# EAGLE design Output_v2_0 (EAGLE 9.6.2)
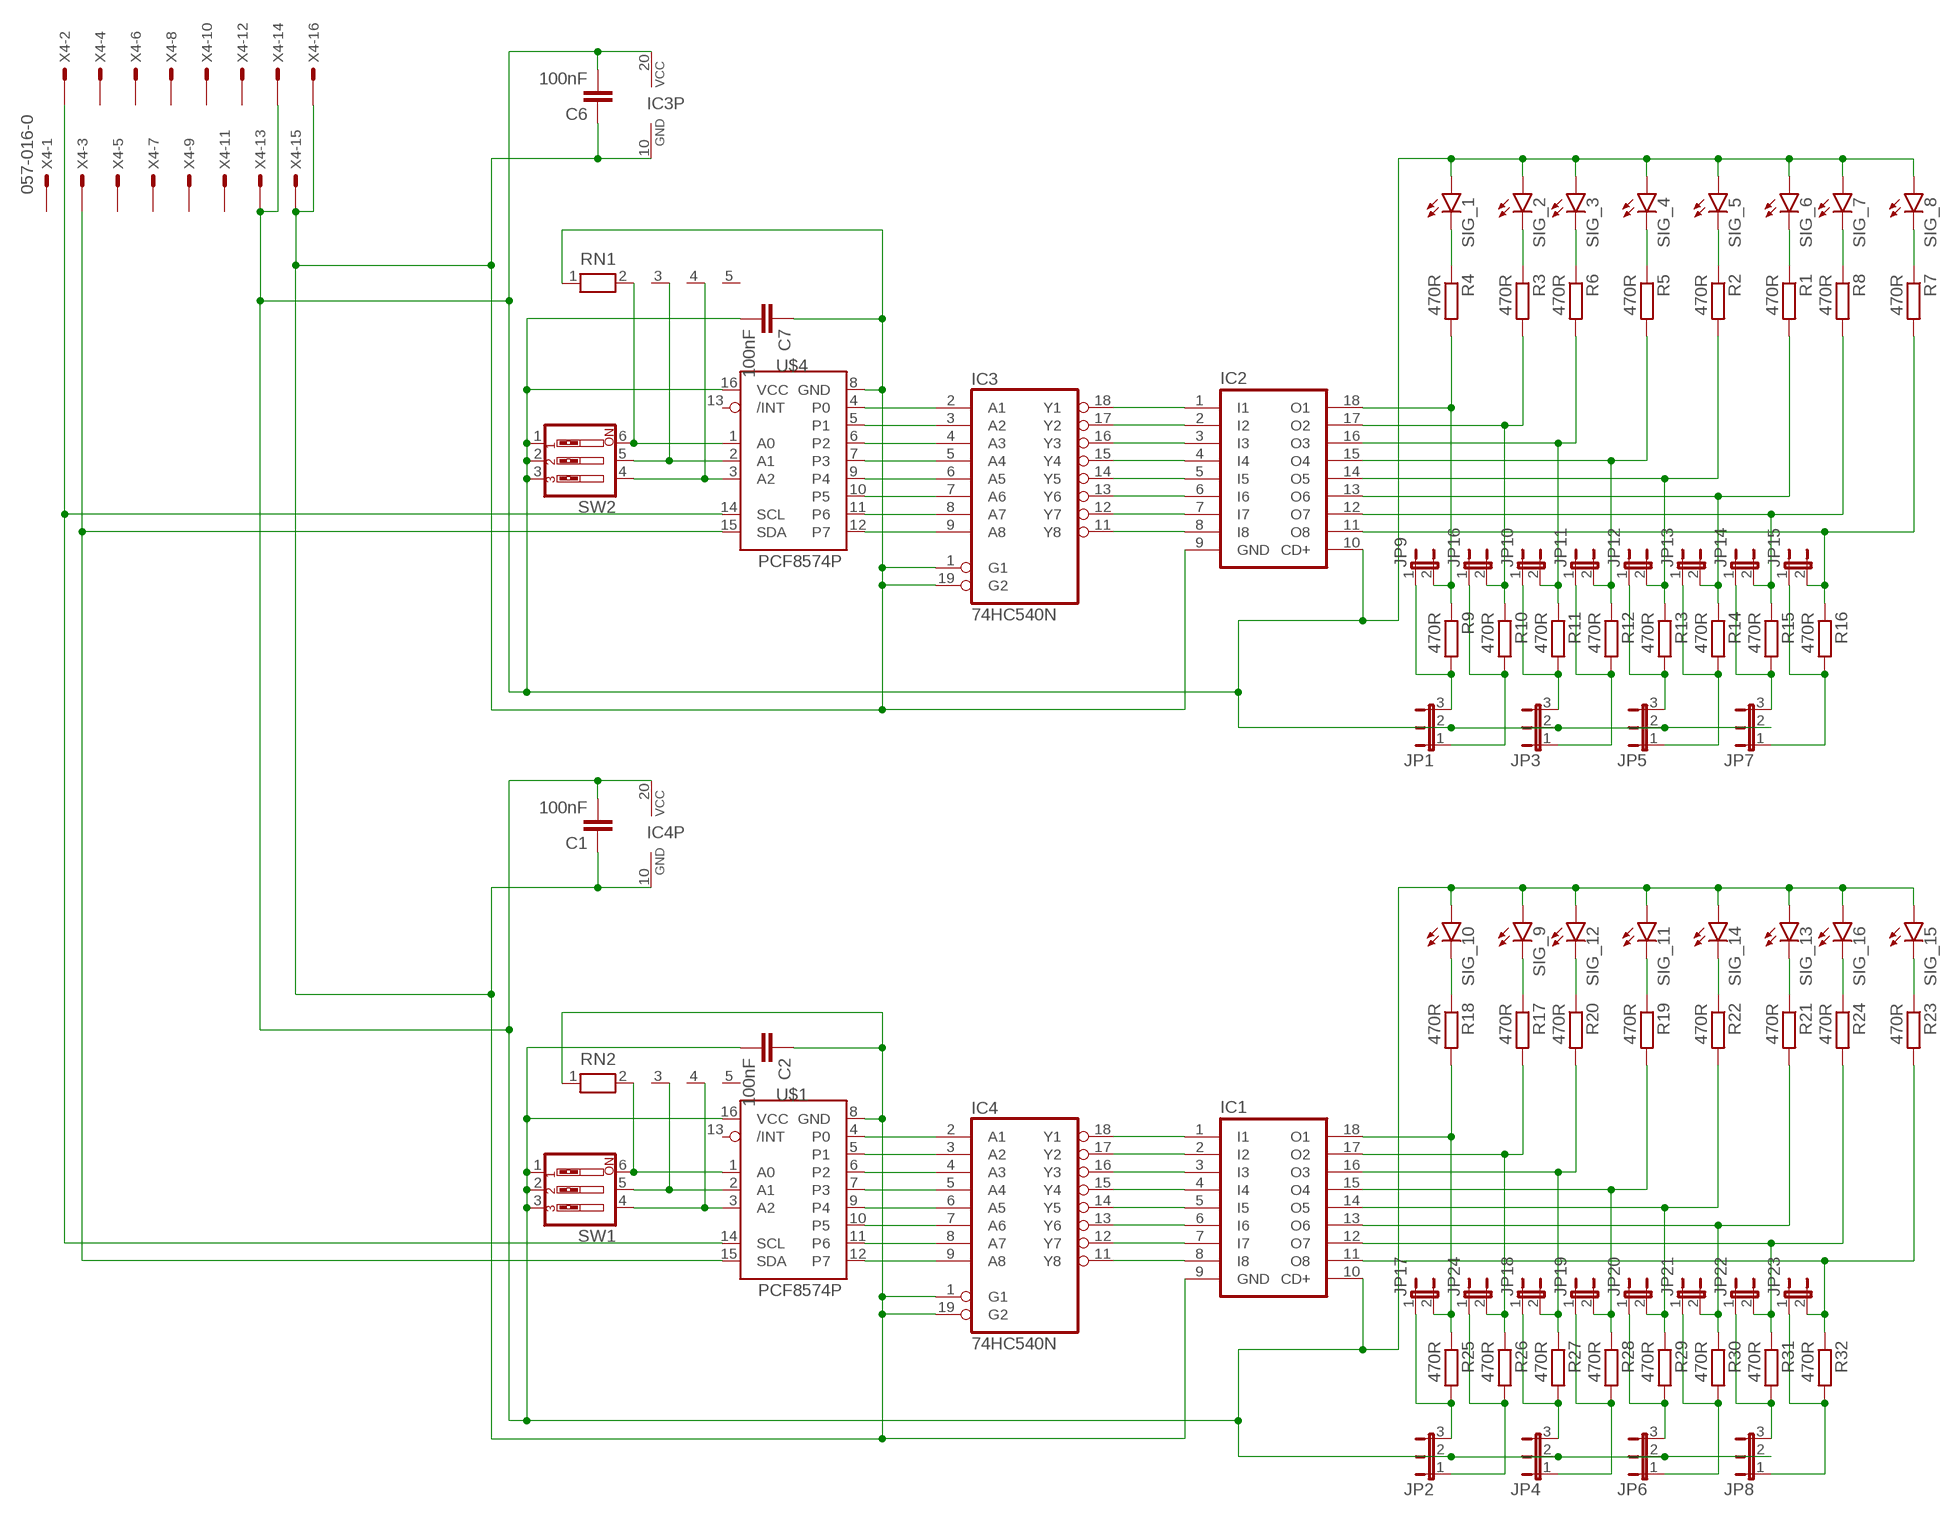
[diagram p0: schematic, sheet 1]

## Parts
C1  100nF  C-EU025-024X044  [C025-024X044]
C2  100nF  C-EU025-024X044  [C025-024X044]
C6  100nF  C-EU025-024X044  [C025-024X044]
C7  100nF  C-EU025-024X044  [C025-024X044]
IC1  ULN2803A  [DIL18]
IC2  ULN2803A  [DIL18]
IC3  74HC540N  [DIL20]
IC4  74HC540N  [DIL20]
JP1  JP2E  [JP2]
JP2  JP2E  [JP2]
JP3  JP2E  [JP2]
JP4  JP2E  [JP2]
JP5  JP2E  [JP2]
JP6  JP2E  [JP2]
JP7  JP2E  [JP2]
JP8  JP2E  [JP2]
JP9  JP1E  [JP1]
JP10  JP1E  [JP1]
JP11  JP1E  [JP1]
JP12  JP1E  [JP1]
JP13  JP1E  [JP1]
JP14  JP1E  [JP1]
JP15  JP1E  [JP1]
JP16  JP1E  [JP1]
JP17  JP1E  [JP1]
JP18  JP1E  [JP1]
JP19  JP1E  [JP1]
JP20  JP1E  [JP1]
JP21  JP1E  [JP1]
JP22  JP1E  [JP1]
JP23  JP1E  [JP1]
JP24  JP1E  [JP1]
R1  470R  R-EU_0309/10  [0309/10]
R2  470R  R-EU_0309/10  [0309/10]
R3  470R  R-EU_0309/10  [0309/10]
R4  470R  R-EU_0309/10  [0309/10]
R5  470R  R-EU_0309/10  [0309/10]
R6  470R  R-EU_0309/10  [0309/10]
R7  470R  R-EU_0309/10  [0309/10]
R8  470R  R-EU_0309/10  [0309/10]
R9  470R  R-EU_0309/10  [0309/10]
R10  470R  R-EU_0309/10  [0309/10]
R11  470R  R-EU_0309/10  [0309/10]
R12  470R  R-EU_0309/10  [0309/10]
R13  470R  R-EU_0309/10  [0309/10]
R14  470R  R-EU_0309/10  [0309/10]
R15  470R  R-EU_0309/10  [0309/10]
R16  470R  R-EU_0309/10  [0309/10]
R17  470R  R-EU_0309/10  [0309/10]
R18  470R  R-EU_0309/10  [0309/10]
R19  470R  R-EU_0309/10  [0309/10]
R20  470R  R-EU_0309/10  [0309/10]
R21  470R  R-EU_0309/10  [0309/10]
R22  470R  R-EU_0309/10  [0309/10]
R23  470R  R-EU_0309/10  [0309/10]
R24  470R  R-EU_0309/10  [0309/10]
R25  470R  R-EU_0309/10  [0309/10]
R26  470R  R-EU_0309/10  [0309/10]
R27  470R  R-EU_0309/10  [0309/10]
R28  470R  R-EU_0309/10  [0309/10]
R29  470R  R-EU_0309/10  [0309/10]
R30  470R  R-EU_0309/10  [0309/10]
R31  470R  R-EU_0309/10  [0309/10]
R32  470R  R-EU_0309/10  [0309/10]
RN1  RN04  [RN-5]
RN2  RN04  [RN-5]
SIG_1  LED3MM  [LED3MM]
SIG_2  LED3MM  [LED3MM]
SIG_3  LED3MM  [LED3MM]
SIG_4  LED3MM  [LED3MM]
SIG_5  LED3MM  [LED3MM]
SIG_6  LED3MM  [LED3MM]
SIG_7  LED3MM  [LED3MM]
SIG_8  LED3MM  [LED3MM]
SIG_9  LED3MM  [LED3MM]
SIG_10  LED3MM  [LED3MM]
SIG_11  LED3MM  [LED3MM]
SIG_12  LED3MM  [LED3MM]
SIG_13  LED3MM  [LED3MM]
SIG_14  LED3MM  [LED3MM]
SIG_15  LED3MM  [LED3MM]
SIG_16  LED3MM  [LED3MM]
SW1  SW_DIP-3  [EDG-03]
SW2  SW_DIP-3  [EDG-03]
U$1  PCF8574P  [DIL16]
U$4  PCF8574P  [DIL16]
X4  057-016-0  [057-016-0]

## Nets
GND2: C1.1 C2.1 C6.1 C7.1 IC1.9(GND) IC2.9(GND) IC3.1(G1) IC3.10(GND) IC3.19(G2) IC4.1(G1) IC4.10(GND) IC4.19(G2) RN1.1 RN2.1 U$1.8(GND) U$4.8(GND) X4.15 X4.16
N$1: JP1.3 JP9.1 R9.2
N$2: IC2.13(O6) JP13.2 R1.2 R14.1
N$3: R2.1 SIG_5.K(C)
N$4: R1.1 SIG_6.K(C)
N$5: IC2.12(O7) JP14.2 R8.2 R15.1
N$6: RN2.4 SW1.4 U$1.3(A2)
N$7: R8.1 SIG_7.K(C)
N$8: R7.1 SIG_8.K(C)
N$9: JP1.1 JP16.1 R10.2
N$10: JP3.3 JP10.1 R11.2
N$11: JP3.1 JP11.1 R12.2
N$12: IC2.8(I8) IC3.11(Y8)
N$13: JP5.3 JP12.1 R13.2
N$14: IC2.7(I7) IC3.12(Y7)
N$15: IC2.6(I6) IC3.13(Y6)
N$16: IC2.5(I5) IC3.14(Y5)
N$17: IC2.4(I4) IC3.15(Y4)
N$18: IC2.3(I3) IC3.16(Y3)
N$19: IC2.2(I2) IC3.17(Y2)
N$20: IC2.1(I1) IC3.18(Y1)
N$21: IC3.2(A1) U$4.4(P0)
N$22: IC3.3(A2) U$4.5(P1)
N$23: IC3.4(A3) U$4.6(P2)
N$24: IC3.5(A4) U$4.7(P3)
N$25: IC3.6(A5) U$4.9(P4)
N$26: IC3.7(A6) U$4.10(P5)
N$27: IC3.8(A7) U$4.11(P6)
N$28: IC3.9(A8) U$4.12(P7)
N$29: IC2.18(O1) JP9.2 R4.2 R9.1
N$30: JP5.1 JP13.1 R14.2
N$31: IC2.17(O2) JP16.2 R3.2 R10.1
N$32: JP7.3 JP14.1 R15.2
N$33: JP7.1 JP15.1 R16.2
N$34: IC1.8(I8) IC4.11(Y8)
N$35: RN2.3 SW1.5 U$1.2(A1)
N$36: R4.1 SIG_1.K(C)
N$37: R3.1 SIG_2.K(C)
N$38: IC2.11(O8) JP15.2 R7.2 R16.1
N$39: IC1.7(I7) IC4.12(Y7)
N$40: IC1.6(I6) IC4.13(Y6)
N$41: IC2.16(O3) JP10.2 R6.2 R11.1
N$42: IC2.15(O4) JP11.2 R5.2 R12.1
N$43: IC2.14(O5) JP12.2 R2.2 R13.1
N$44: IC1.5(I5) IC4.14(Y5)
N$45: IC1.4(I4) IC4.15(Y4)
N$46: IC1.3(I3) IC4.16(Y3)
N$47: IC1.2(I2) IC4.17(Y2)
N$48: IC1.1(I1) IC4.18(Y1)
N$49: IC4.2(A1) U$1.4(P0)
N$50: IC4.3(A2) U$1.5(P1)
N$51: IC4.4(A3) U$1.6(P2)
N$52: IC4.5(A4) U$1.7(P3)
N$53: R6.1 SIG_3.K(C)
N$54: R5.1 SIG_4.K(C)
N$55: IC4.6(A5) U$1.9(P4)
N$56: IC4.7(A6) U$1.10(P5)
N$57: IC4.8(A7) U$1.11(P6)
N$58: IC4.9(A8) U$1.12(P7)
N$59: IC1.18(O1) JP17.2 R18.2 R25.1
N$60: IC1.17(O2) JP24.2 R17.2 R26.1
N$61: R18.1 SIG_10.K(C)
N$62: R17.1 SIG_9.K(C)
N$63: IC1.16(O3) JP18.2 R20.2 R27.1
N$64: IC1.15(O4) JP19.2 R19.2 R28.1
N$65: IC1.14(O5) JP20.2 R22.2 R29.1
N$66: R20.1 SIG_12.K(C)
N$67: R19.1 SIG_11.K(C)
N$68: IC1.13(O6) JP21.2 R21.2 R30.1
N$69: R22.1 SIG_14.K(C)
N$70: R21.1 SIG_13.K(C)
N$71: IC1.12(O7) JP22.2 R24.2 R31.1
N$72: R24.1 SIG_16.K(C)
N$73: R23.1 SIG_15.K(C)
N$74: JP2.3 JP17.1 R25.2
N$75: JP2.1 JP24.1 R26.2
N$76: JP4.3 JP18.1 R27.2
N$77: JP4.1 JP19.1 R28.2
N$78: JP6.3 JP20.1 R29.2
N$79: JP6.1 JP21.1 R30.2
N$80: JP8.3 JP22.1 R31.2
N$81: JP8.1 JP23.1 R32.2
N$82: U$1.14(SCL) U$4.14(SCL) X4.2
N$83: IC1.11(O8) JP23.2 R23.2 R32.1
N$84: U$1.15(SDA) U$4.15(SDA) X4.3
N$85: RN2.2 SW1.6 U$1.1(A0)
N$86: RN1.2 SW2.6 U$4.1(A0)
N$87: RN1.3 SW2.5 U$4.2(A1)
N$88: RN1.4 SW2.4 U$4.3(A2)
VCC5.1: C1.2 C2.2 C6.2 C7.2 IC1.10(CD+) IC2.10(CD+) IC3.20(VCC) IC4.20(VCC) JP1.2 JP2.2 JP3.2 JP4.2 JP5.2 JP6.2 JP7.2 JP8.2 SIG_1.A SIG_2.A SIG_3.A SIG_4.A SIG_5.A SIG_6.A SIG_7.A SIG_8.A SIG_9.A SIG_10.A SIG_11.A SIG_12.A SIG_13.A SIG_14.A SIG_15.A SIG_16.A SW1.1 SW1.2 SW1.3 SW2.1 SW2.2 SW2.3 U$1.16(VCC) U$4.16(VCC) X4.13 X4.14
Unconnected: RN1.5 RN2.5 U$1.13(/INT) U$4.13(/INT) X4.1 X4.4 X4.5 X4.6 X4.7 X4.8 X4.9 X4.10 X4.11 X4.12

## Library data of the parts
C1 C2 C6 C7 = resistor:C-EU: CAPACITOR, European symbol
IC1 IC2 = uln-udn:ULN2803A: DRIVER ARRAY
IC3 IC4 = 74xx-eu:74*540: Inverting Octal BUFFER and LINE DRIVER, 3-state
JP1-JP8 = jumper:JP2E: JUMPER
JP9-JP24 = jumper:JP1E: JUMPER
R1-R32 = resistor:R-EU_: RESISTOR, European symbol
RN1 RN2 = resistor-net:RN04: RESISTOR NETWORK; OC_FARNELL: unknown; OC_NEWARK: unknown
SIG_1-SIG_16 = led:LED: LED OSRAM: - CHIPLED LG R971, LG N971, LY N971, LG Q971, LY Q971, LO R971, LY R971 LH N974, LH R974 LS Q976, LO Q976, LY Q976 LO Q996 - Hyper CHIPLED LW Q18S LB Q993, LB Q99A, LB R99A - SideLED LS A670, LO A670, LY A670, LG A670, LP A670 LB A673, LV A673, LT A673, LW A673 LH A674 LY A675 LS A676, LA A676, LO A676, LY A676, LW A676 LS A679, LY A679, LG A679 - Hyper Micro SIDELED® LS Y876, LA Y876, LO Y876, LY Y876 LT Y87S - SmartLED LW L88C, LW L88S LB L89C, LB L89S, LG L890 LS L89K, LO L89K, LY L89K LS L896, LA L896, LO L896, LY L896 - TOPLED LS T670, LO T670, LY T670, LG T670, LP T670 LSG T670, LSP T670, LSY T670, LOP T670, LYG T670 LG T671, LOG T671, LSG T671 LB T673, LV T673, LT T673, LW T673 LH T674 LS T676, LA T676, LO T676, LY T676, LB T676, LH T676, LSB T676, LW T676 LB T67C, LV T67C, LT T67C, LS T67K, LO T67K, LY T67K, LW E67C LS E67B, LA E67B, LO E67B, LY E67B, LB E67C, LV E67C, LT E67C LW T67C LS T679, LY T679, LG T679 LS T770, LO T770, LY T770, LG T770, LP T770 LB T773, LV T773, LT T773, LW T773 LH T774 LS E675, LA E675, LY E675, LS T675 LS T776, LA T776, LO T776, LY T776, LB T776 LHGB T686 LT T68C, LB T68C - Hyper Mini TOPLED® LB M676 - Mini TOPLED Santana® LG M470 LS M47K, LO M47K, LY M47K Source: http://www.osram.convergy.de LUXEON: - LUMILED® LXK2-PW12-R00, LXK2-PW12-S00, LXK2-PW14-U00, LXK2-PW14-V00 LXK2-PM12-R00, LXK2-PM12-S00, LXK2-PM14-U00 LXK2-PE12-Q00, LXK2-PE12-R00, LXK2-PE12-S00, LXK2-PE14-T00, LXK2-PE14-U00 LXK2-PB12-K00, LXK2-PB12-L00, LXK2-PB12-M00, LXK2-PB14-N00, LXK2-PB14-P00, LXK2-PB14-Q00 LXK2-PR12-L00, LXK2-PR12-M00, LXK2-PR14-Q00, LXK2-PR14-R00 LXK2-PD12-Q00, LXK2-PD12-R00, LXK2-PD12-S00 LXK2-PH12-R00, LXK2-PH12-S00 LXK2-PL12-P00, LXK2-PL12-Q00, LXK2-PL12-R00 Source: www.luxeon.com KINGBRIGHT: KA-3528ASYC Source: www.kingbright.com
SW1 SW2 = special:SW_DIP-3: DIP SWITCH
U$1 U$4 = i2c:PCF8574: Remote 8-Bit I/O Expander for I²C Bus
X4 = con-panduit:057-016-: CONNECTOR 10-pin series 057 contact pc board low profile headers; OC_FARNELL: unknown; OC_NEWARK: unknown

## Board
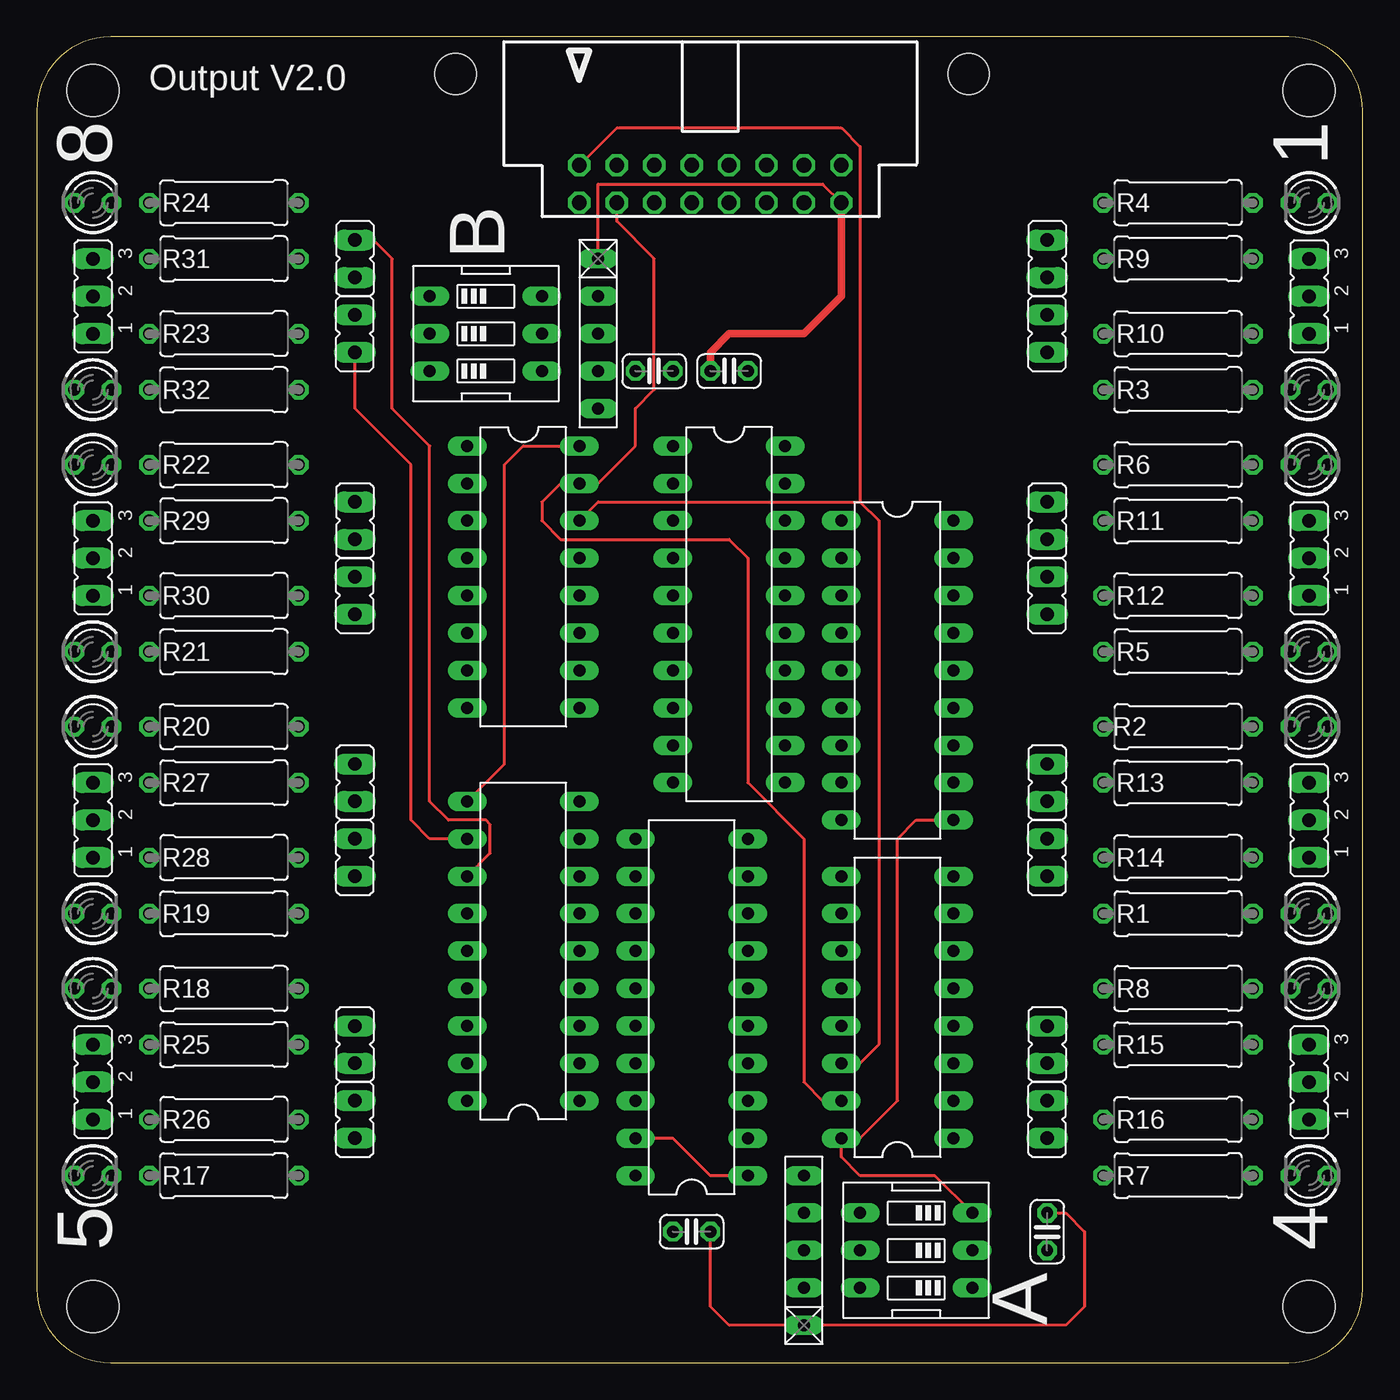
[diagram p1: board, top side]
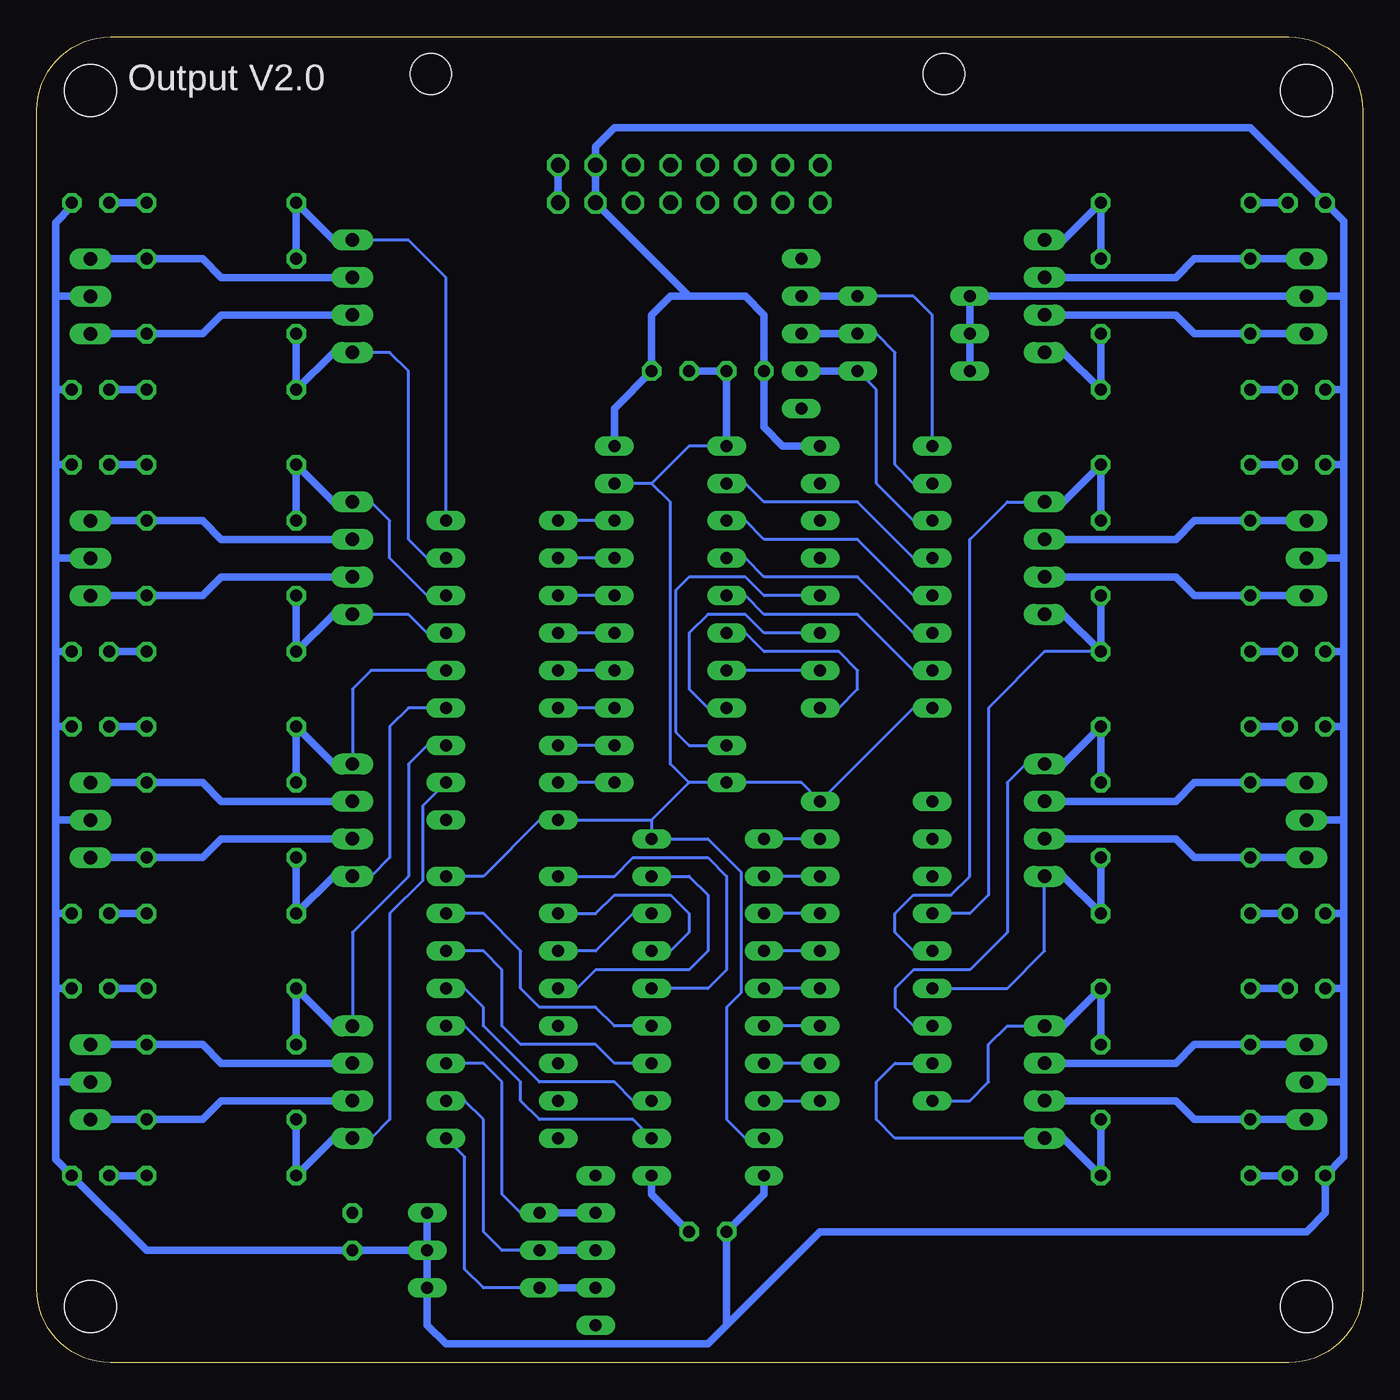
[diagram p2: board, bottom side, seen from below]

Size 90 x 90 mm. Coordinates in mm from the lower left corner, seen from the top.
Outline: 0,85 0,5 arc90 5,0 85,0 arc90 90,5 90,85 arc90 85,90 5,90 arc90 0,85
Copper layers (1*16): Top 0.035mm / dielectric 1.5mm / Bottom 0.035mm
Design rules "default": minimum track width 6mil, minimum drill 0.35mm, track to track 6mil, track to pad 6mil, pad to pad 6mil, via to via 6mil, smd to smd 6mil, copper to edge 40mil, drill to drill 6mil, minimum pad ring 10mil, minimum via ring 8mil, stop-mask expansion 4mil, vias tented up to drill 0mil, thermal gap 10mil
Holes 3.5 mm at 86.36,86.36 3.81,86.36 3.81,3.81 86.36,3.81

### Footprints (pad centres in the part's own frame; a part is rotated, then mirrored left to right if it is on the bottom)
C025-024X044 = drill 0.813 octagon: 1 -1.27,0; 2 1.27,0
DIL18 = drill 0.813 long: 1 -10.16,-3.81; 2 -7.62,-3.81; 3 -5.08,-3.81; 4 -2.54,-3.81; 5 0,-3.81; 6 2.54,-3.81; 7 5.08,-3.81; 8 7.62,-3.81; 9 10.16,-3.81; 10 10.16,3.81; 11 7.62,3.81; 12 5.08,3.81; 13 2.54,3.81; 14 0,3.81; 15 -2.54,3.81; 16 -5.08,3.81; 17 -7.62,3.81; 18 -10.16,3.81
DIL20 = drill 0.813 long: 1 -11.43,-3.81; 2 -8.89,-3.81; 3 -6.35,-3.81; 4 -3.81,-3.81; 5 -1.27,-3.81; 6 1.27,-3.81; 7 3.81,-3.81; 8 6.35,-3.81; 9 8.89,-3.81; 10 11.43,-3.81; 11 11.43,3.81; 12 8.89,3.81; 13 6.35,3.81; 14 3.81,3.81; 15 1.27,3.81; 16 -1.27,3.81; 17 -3.81,3.81; 18 -6.35,3.81; 19 -8.89,3.81; 20 -11.43,3.81
JP2 = drill 0.914 long: 1 -2.54,0; 2 0,0; 3 2.54,0
JP1 = drill 0.914 long: 1 0,-1.27; 2 0,1.27
0309/10 = drill 0.813 octagon: 1 -5.08,0; 2 5.08,0
RN-5 = drill 0.813 long: 1 -5.08,0; 2 -2.54,0; 3 0,0; 4 2.54,0; 5 5.08,0
LED3MM = drill 0.813 octagon: A -1.27,0; K 1.27,0
EDG-03 = drill 0.813 long: 1 -2.54,-3.81; 2 0,-3.81; 3 2.54,-3.81; 4 2.54,3.81; 5 0,3.81; 6 -2.54,3.81
DIL16 = drill 0.813 long: 1 -8.89,-3.81; 2 -6.35,-3.81; 3 -3.81,-3.81; 4 -1.27,-3.81; 5 1.27,-3.81; 6 3.81,-3.81; 7 6.35,-3.81; 8 8.89,-3.81; 9 8.89,3.81; 10 6.35,3.81; 11 3.81,3.81; 12 1.27,3.81; 13 -1.27,3.81; 14 -3.81,3.81; 15 -6.35,3.81; 16 -8.89,3.81
057-016-0 = drill 1 octagon: 1 -8.89,-5.08; 2 -8.89,-2.54; 3 -6.35,-5.08; 4 -6.35,-2.54; 5 -3.81,-5.08; 6 -3.81,-2.54; 7 -1.27,-5.08; 8 -1.27,-2.54; 9 1.27,-5.08; 10 1.27,-2.54; 11 3.81,-5.08; 12 3.81,-2.54; 13 6.35,-5.08; 14 6.35,-2.54; 15 8.89,-5.08; 16 8.89,-2.54 | hole 2.8: -17.29,3.66; 17.54,3.66

### Placement (x,y rotation side)
C1  44.45,8.89 180 top
C2  68.58,8.89 270 top
C6  41.91,67.31 180 top
C7  46.99,67.31 0 top
IC1  33.02,27.94 90 top
IC2  58.42,46.99 270 top
IC3  46.99,50.8 270 top
IC4  44.45,24.13 90 top
JP1  86.36,72.39 90 top
JP2  3.81,19.05 90 top
JP3  86.36,54.61 90 top
JP4  3.81,36.83 90 top
JP5  86.36,36.83 90 top
JP6  3.81,54.61 90 top
JP7  86.36,19.05 90 top
JP8  3.81,72.39 90 top
JP9  68.58,74.93 0 top
JP10  68.58,57.15 0 top
JP11  68.58,52.07 180 top
JP12  68.58,39.37 0 top
JP13  68.58,34.29 180 top
JP14  68.58,21.59 0 top
JP15  68.58,16.51 180 top
JP16  68.58,69.85 180 top
JP17  21.59,21.59 0 top
JP18  21.59,39.37 0 top
JP19  21.59,34.29 180 top
JP20  21.59,57.15 0 top
JP21  21.59,52.07 180 top
JP22  21.59,74.93 0 top
JP23  21.59,69.85 180 top
JP24  21.59,16.51 180 top
R1  77.47,30.48 180 top
R2  77.47,43.18 180 top
R3  77.47,66.04 180 top
R4  77.47,78.74 180 top
R5  77.47,48.26 180 top
R6  77.47,60.96 180 top
R7  77.47,12.7 180 top
R8  77.47,25.4 180 top
R9  77.47,74.93 0 top
R10  77.47,69.85 0 top
R11  77.47,57.15 0 top
R12  77.47,52.07 0 top
R13  77.47,39.37 0 top
R14  77.47,34.29 0 top
R15  77.47,21.59 0 top
R16  77.47,16.51 0 top
R17  12.7,12.7 0 top
R18  12.7,25.4 0 top
R19  12.7,30.48 0 top
R20  12.7,43.18 0 top
R21  12.7,48.26 0 top
R22  12.7,60.96 0 top
R23  12.7,66.04 0 top
R24  12.7,78.74 0 top
R25  12.7,21.59 180 top
R26  12.7,16.51 180 top
R27  12.7,39.37 180 top
R28  12.7,34.29 180 top
R29  12.7,57.15 180 top
R30  12.7,52.07 180 top
R31  12.7,74.93 180 top
R32  12.7,69.85 180 top
RN1  38.1,69.85 270 top
RN2  52.07,7.62 90 top
SIG_1  86.36,78.74 180 top
SIG_2  86.36,66.04 180 top
SIG_3  86.36,60.96 180 top
SIG_4  86.36,48.26 180 top
SIG_5  86.36,43.18 180 top
SIG_6  86.36,30.48 180 top
SIG_7  86.36,25.4 180 top
SIG_8  86.36,12.7 180 top
SIG_9  3.81,12.7 0 top
SIG_10  3.81,25.4 0 top
SIG_11  3.81,30.48 0 top
SIG_12  3.81,43.18 0 top
SIG_13  3.81,48.26 0 top
SIG_14  3.81,60.96 0 top
SIG_15  3.81,66.04 0 top
SIG_16  3.81,78.74 0 top
SW1  59.69,7.62 90 top
SW2  30.48,69.85 270 top
U$1  58.42,24.13 90 top
U$4  33.02,53.34 270 top
X4  45.72,83.82 0 top

### Tracks (layer width: path | path; a pad name or v marks a point on that pad's centre or on a via)
GND2
  Top 0.2: C2.1 69.85,10.16 71.12,8.89 71.12,3.81 69.85,2.54 RN2.1 46.99,2.54 45.72,3.81 C1.1 | IC4.1 45.72,12.7 43.18,15.24 IC4.19 | RN1.1 38.1,80.01 53.34,80.01 X4.15
  Top 0.508: X4.15 54.61,72.39 52.07,69.85 46.99,69.85 45.72,68.58 C7.1
  Bottom 0.2: U$4.8 30.48,44.45 IC1.9 38.1,39.37 IC3.10 45.72,39.37 | 45.72,39.37 48.26,36.83 | 48.26,36.83 IC4.10 44.45,35.56 42.21,33.32 42.21,25.1 43.18,24.13 43.18,16.51 41.91,15.24 IC4.19 | 48.26,36.83 IC2.9 55.88,36.83 59.69,33.02 U$1.8 | 45.72,39.37 46.99,40.64 46.99,58.42 48.26,59.69 | 48.26,59.69 IC3.19 | IC3.1 45.72,62.23 48.26,59.69
  Bottom 0.508: C1.1 48.26,11.43 IC4.1 | X4.16 X4.15 | C7.1 C6.1 IC3.1
N$1
  Bottom 0.508: JP1.3 R9.2 78.74,74.93 77.47,73.66 JP9.1
N$2
  Bottom 0.2: IC2.13 64.77,44.45 66.04,43.18 66.04,34.29 67.31,33.02 JP13.2
  Bottom 0.508: R14.1 R1.2 69.85,33.02 JP13.2
N$3
  Bottom 0.508: R2.1 SIG_5.K
N$4
  Bottom 0.508: R1.1 SIG_6.K
N$5
  Bottom 0.2: IC2.12 63.5,41.91 64.77,40.64 64.77,33.02 68.58,29.21 JP14.2
  Bottom 0.508: R15.1 R8.2 69.85,22.86 JP14.2
N$6
  Bottom 0.2: SW1.4 57.15,10.16 58.42,11.43 58.42,19.05 59.69,20.32 U$1.3
  Bottom 0.508: SW1.4 RN2.4
N$7
  Bottom 0.508: R8.1 SIG_7.K
N$8
  Bottom 0.508: R7.1 SIG_8.K
N$9
  Bottom 0.508: JP1.1 R10.2 78.74,69.85 77.47,71.12 JP16.1
N$10
  Bottom 0.508: JP3.3 R11.2 78.74,57.15 77.47,55.88 JP10.1
N$11
  Bottom 0.508: JP3.1 R12.2 78.74,52.07 77.47,53.34 JP11.1
N$12
  Bottom 0.2: IC3.11 IC2.8
N$13
  Bottom 0.508: JP5.3 R13.2 78.74,39.37 77.47,38.1 JP12.1
N$14
  Bottom 0.2: IC3.12 IC2.7
N$15
  Bottom 0.2: IC3.13 IC2.6
N$16
  Bottom 0.2: IC3.14 IC2.5
N$17
  Bottom 0.2: IC3.15 IC2.4
N$18
  Bottom 0.2: IC3.16 IC2.3
N$19
  Bottom 0.2: IC3.17 IC2.2
N$20
  Bottom 0.2: IC3.18 IC2.1
N$21
  Bottom 0.2: U$4.4 30.48,54.61 34.29,58.42 40.64,58.42 41.91,59.69 IC3.2
N$22
  Bottom 0.2: U$4.5 30.48,52.07 34.29,55.88 40.64,55.88 41.91,57.15 IC3.3
N$23
  Bottom 0.2: U$4.6 30.48,49.53 34.29,53.34 40.64,53.34 41.91,54.61 IC3.4
N$24
  Bottom 0.2: U$4.7 30.48,46.99 34.29,50.8 40.64,50.8 41.91,52.07 IC3.5
N$25
  Bottom 0.2: U$4.9 35.56,44.45 34.29,45.72 34.29,46.99 35.56,48.26 40.64,48.26 41.91,49.53 IC3.6
N$26
  Bottom 0.2: U$4.10 IC3.7
N$27
  Bottom 0.2: U$4.11 40.64,49.53 41.91,50.8 44.45,50.8 45.72,49.53 45.72,45.72 44.45,44.45 IC3.8
N$28
  Bottom 0.2: U$4.12 40.64,52.07 41.91,53.34 45.72,53.34 46.64,52.42 46.64,42.83 45.72,41.91 IC3.9
N$29
  Bottom 0.2: IC2.18 62.23,73.66 64.77,76.2 JP9.2
  Bottom 0.508: R9.1 R4.2 69.85,76.2 JP9.2
N$30
  Bottom 0.508: JP5.1 R14.2 78.74,34.29 77.47,35.56 JP13.1
N$31
  Bottom 0.2: IC2.17 63.5,54.61 64.77,55.88 64.77,67.31 66.04,68.58 JP16.2
  Bottom 0.508: R10.1 R3.2 69.85,68.58 JP16.2
N$32
  Bottom 0.508: JP7.3 R15.2 78.74,21.59 77.47,20.32 JP14.1
N$33
  Bottom 0.508: JP7.1 R16.2 78.74,16.51 77.47,17.78 JP15.1
N$34
  Bottom 0.2: IC1.8 IC4.11
N$35
  Bottom 0.2: SW1.5 58.42,7.62 59.69,8.89 59.69,16.51 60.96,17.78 U$1.2
  Bottom 0.508: SW1.5 RN2.3
N$36
  Bottom 0.508: R4.1 SIG_1.K
N$37
  Bottom 0.508: R3.1 SIG_2.K
N$38
  Bottom 0.2: IC2.11 63.8,37.8 63.8,32.72 66.04,30.48 66.04,16.51 67.31,15.24 JP15.2
  Bottom 0.508: R16.1 R7.2 69.85,15.24 JP15.2
N$39
  Bottom 0.2: IC1.7 IC4.12
N$40
  Bottom 0.2: IC1.6 IC4.13
N$41
  Bottom 0.2: IC2.16 63.5,52.07 66.04,54.61 66.04,57.15 67.31,58.42 JP10.2
  Bottom 0.508: R11.1 R6.2 69.85,58.42 JP10.2
N$42
  Bottom 0.2: IC2.15 63.5,49.53 64.77,50.8 JP11.2
  Bottom 0.508: R12.1 R5.2 69.85,50.8 JP11.2
N$43
  Bottom 0.2: IC2.14 67.31,46.99 68.58,45.72 JP12.2
  Bottom 0.508: JP12.2 69.85,40.64 R2.2 R13.1
N$44
  Bottom 0.2: IC1.5 IC4.14
N$45
  Bottom 0.2: IC1.4 IC4.15
N$46
  Bottom 0.2: IC1.3 IC4.16
N$47
  Bottom 0.2: IC1.2 IC4.17
N$48
  Bottom 0.2: IC4.18 IC1.1
N$49
  Bottom 0.2: IC4.2 49.53,16.51 55.88,16.51 57.15,17.78 57.15,19.05 60.96,22.86 U$1.4
N$50
  Bottom 0.2: IC4.3 49.53,17.78 50.8,19.05 55.88,19.05 59.69,22.86 59.69,24.13 60.96,25.4 U$1.5
N$51
  Bottom 0.2: U$1.6 59.69,27.94 58.42,26.67 58.42,22.86 57.15,21.59 52.07,21.59 50.8,20.32 IC4.4
N$52
  Bottom 0.2: U$1.7 59.69,30.48 57.15,27.94 57.15,25.4 55.88,24.13 52.07,24.13 50.8,22.86 IC4.5
N$53
  Bottom 0.508: SIG_3.K R6.1
N$54
  Bottom 0.508: R5.1 SIG_4.K
N$55
  Bottom 0.2: U$1.9 50.8,33.02 49.53,34.29 44.45,34.29 43.18,33.02 43.18,26.67 44.45,25.4 IC4.6
N$56
  Bottom 0.2: U$1.10 52.07,30.48 50.8,31.75 46.99,31.75 45.72,30.48 45.72,29.21 46.99,27.94 IC4.7
N$57
  Bottom 0.2: IC4.8 49.53,30.48 52.07,27.94 U$1.11
N$58
  Bottom 0.2: IC4.9 45.72,33.02 44.45,31.75 44.45,27.94 45.72,26.67 52.07,26.67 53.34,25.4 U$1.12
N$59
  Bottom 0.2: IC1.18 26.67,17.78 25.4,19.05 25.4,21.59 24.13,22.86 JP17.2
  Bottom 0.508: R25.1 R18.2 20.32,22.86 JP17.2
N$60
  Bottom 0.2: IC1.17 31.75,20.32 33.02,19.05 33.02,16.51 31.75,15.24 JP24.2
  Bottom 0.508: R26.1 R17.2 20.32,15.24 JP24.2
N$61
  Bottom 0.508: SIG_10.K R18.1
N$62
  Bottom 0.508: SIG_9.K R17.1
N$63
  Bottom 0.2: JP18.2 22.86,40.64 24.13,39.37 24.13,29.21 26.67,26.67 30.48,26.67 31.75,25.4 31.75,24.13 30.48,22.86 IC1.16
  Bottom 0.508: R27.1 R20.2 20.32,40.64 JP18.2
N$64
  Bottom 0.2: IC1.15 24.13,25.4 21.59,27.94 JP19.2
  Bottom 0.508: R28.1 R19.2 20.32,33.02 JP19.2
N$65
  Bottom 0.2: IC1.14 30.48,27.94 31.75,29.21 31.75,30.48 30.48,31.75 27.94,31.75 26.67,33.02 26.67,55.88 24.13,58.42 JP20.2
  Bottom 0.508: R29.1 R22.2 20.32,58.42 JP20.2
N$66
  Bottom 0.508: SIG_12.K R20.1
N$67
  Bottom 0.508: SIG_11.K R19.1
N$68
  Bottom 0.2: R21.2 21.59,48.26 25.4,44.45 25.4,31.75 26.67,30.48 IC1.13
  Bottom 0.508: R30.1 R21.2 20.32,50.8 JP21.2
N$69
  Bottom 0.508: SIG_14.K R22.1
N$70
  Bottom 0.508: SIG_13.K R21.1
N$71
  Top 0.2: IC1.12 30.78,34.59 30.78,36.53 30.48,36.83 27.94,36.83 26.67,38.1 26.67,62.23 24.13,64.77 24.13,74.93 22.86,76.2 JP22.2
  Bottom 0.508: R31.1 R24.2 20.32,76.2 JP22.2
N$72
  Bottom 0.508: SIG_16.K R24.1
N$73
  Bottom 0.508: SIG_15.K R23.1
N$74
  Bottom 0.508: JP2.3 R25.2 11.43,21.59 12.7,20.32 JP17.1
N$75
  Bottom 0.508: JP2.1 R26.2 11.43,16.51 12.7,17.78 JP24.1
N$76
  Bottom 0.508: JP4.3 R27.2 11.43,39.37 12.7,38.1 JP18.1
N$77
  Bottom 0.508: JP4.1 R28.2 11.43,34.29 12.7,35.56 JP19.1
N$78
  Bottom 0.508: JP6.3 R29.2 11.43,57.15 12.7,55.88 JP20.1
N$79
  Bottom 0.508: JP6.1 R30.2 11.43,52.07 12.7,53.34 JP21.1
N$80
  Bottom 0.508: JP8.3 R31.2 11.43,74.93 12.7,73.66 JP22.1
N$81
  Bottom 0.508: JP8.1 R32.2 11.43,69.85 12.7,71.12 JP23.1
N$82
  Top 0.2: U$4.14 38.1,58.42 55.88,58.42 | 55.88,58.42 57.15,57.15 57.15,21.59 55.88,20.32 U$1.14 | X4.2 39.37,83.82 54.61,83.82 55.88,82.55 55.88,58.42
N$83
  Top 0.2: IC1.11 26.67,35.56 25.4,36.83 25.4,60.96 21.59,64.77 JP23.2
  Bottom 0.508: R32.1 R23.2 20.32,68.58 JP23.2
N$84
  Top 0.2: U$1.15 53.34,17.78 52.07,19.05 52.07,35.56 48.26,39.37 48.26,54.61 46.99,55.88 35.56,55.88 34.29,57.15 34.29,58.42 35.56,59.69 U$4.15 38.1,59.69 40.64,62.23 40.64,64.77 41.91,66.04 41.91,74.93 39.37,77.47 X4.3
N$85
  Bottom 0.2: SW1.6 59.69,5.08 60.96,6.35 60.96,13.97 U$1.1
  Bottom 0.508: SW1.6 RN2.2
N$86
  Bottom 0.2: U$4.1 29.21,71.12 30.48,72.39 SW2.6
  Bottom 0.508: SW2.6 RN1.2
N$87
  Bottom 0.2: U$4.2 30.48,59.69 31.75,60.96 31.75,68.58 33.02,69.85 SW2.5
  Bottom 0.508: SW2.5 RN1.3
N$88
  Bottom 0.2: U$4.3 30.48,57.15 33.02,59.69 33.02,66.04 SW2.4
  Bottom 0.508: SW2.4 RN1.4
VCC5.1
  Top 0.2: SW1.3 60.96,12.7 55.88,12.7 54.61,13.97 U$1.16 55.88,15.24 58.42,17.78 58.42,35.56 59.69,36.83 IC2.10 | IC1.10 31.75,40.64 31.75,60.96 33.02,62.23 U$4.16
  Bottom 0.508: 1.27,72.39 1.27,77.47 SIG_16.A 7.62,83.82 50.8,83.82 52.07,82.55 X4.14 X4.13 45.72,72.39 | 1.27,72.39 JP8.2 SW2.1 SW2.2 SW2.3 | 1.27,72.39 1.27,66.04 | 1.27,66.04 1.27,60.96 | 1.27,60.96 1.27,54.61 | 1.27,54.61 1.27,48.26 | 1.27,48.26 1.27,43.18 | 1.27,43.18 1.27,36.83 | 1.27,36.83 1.27,30.48 | 1.27,30.48 1.27,25.4 | 1.27,25.4 1.27,19.05 | 1.27,19.05 1.27,13.97 SIG_9.A 2.54,10.16 3.81,8.89 36.83,8.89 43.18,2.54 | JP2.2 1.27,19.05 | JP4.2 1.27,36.83 | JP6.2 1.27,54.61 | SIG_15.A 1.27,66.04 | SIG_14.A 1.27,60.96 | SIG_13.A 1.27,48.26 | SIG_12.A 1.27,43.18 | SIG_11.A 1.27,30.48 | SIG_10.A 1.27,25.4 | SIG_1.A 87.63,78.49 88.73,77.39 88.73,72.39 | 88.73,72.39 88.73,66.04 | 88.73,66.04 88.73,60.96 | 88.73,60.96 88.73,54.61 | 88.73,54.61 88.73,48.26 | 88.73,48.26 88.73,43.18 | 88.73,43.18 88.73,36.83 | 88.73,36.83 88.73,30.48 | 88.73,30.48 88.73,25.4 | 88.73,25.4 88.73,19.05 | 88.73,19.05 88.73,13.8 SIG_8.A 82.55,7.62 C2.2 SW1.2 | JP7.2 88.73,19.05 | SIG_7.A 88.73,25.4 | SIG_6.A 88.73,30.48 | JP5.2 88.73,36.83 | SIG_5.A 88.73,43.18 | SIG_4.A 88.73,48.26 | JP3.2 88.73,54.61 | SIG_3.A 88.73,60.96 | SIG_2.A 88.73,66.04 | JP1.2 88.73,72.39 | SW1.2 SW1.3 | SW1.2 SW1.1 63.5,2.54 62.23,1.27 44.45,1.27 43.18,2.54 | 43.18,2.54 C1.2 40.64,11.43 IC4.20 | 45.72,72.39 41.91,72.39 40.64,71.12 C6.2 40.64,63.5 39.37,62.23 U$4.16 | IC3.20 50.8,64.77 C7.2 48.26,71.12 46.99,72.39 45.72,72.39

### Text on the board
tNames: Output V2.0 | 8 | 1 | B | 5 | 4 | A
bNames: Output V2.0